# EAGLE design carte_bouton (EAGLE 6.5.0)
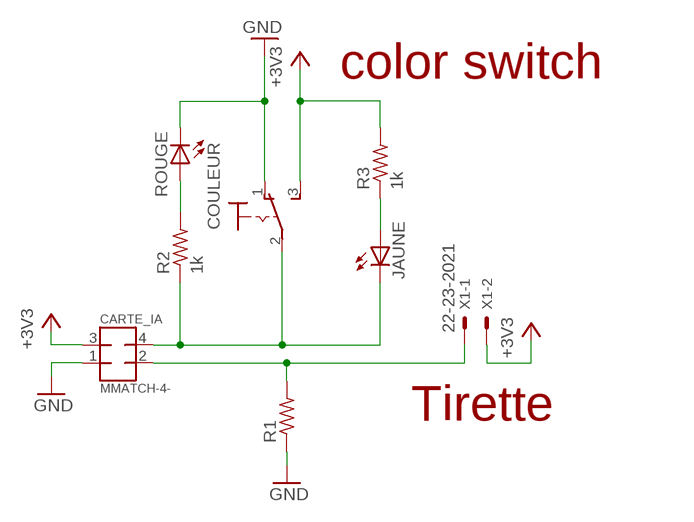
[diagram p0: schematic, sheet 1]

## Parts
CARTE_IA  MMATCH-4-  [AMP-215079-4]
COULEUR  320-916  [320-916]
JAUNE  LEDSML0805  [SML0805]
R1  R-US_R0805  [R0805]
R2  1k  R-US_M0805  [M0805]
R3  1k  R-US_M0805  [M0805]
ROUGE  LEDSML0805  [SML0805]
X1  22-23-2021  [22-23-2021]

## Nets
+3V3: CARTE_IA.3 COULEUR.3(S) R3.2 X1.2
GND: CARTE_IA.1 COULEUR.1(O) R1.1 ROUGE.C
N$1: CARTE_IA.4 COULEUR.2(P) JAUNE.C R2.1
N$2: R2.2 ROUGE.A
N$3: JAUNE.A R3.1
TIRETTE: CARTE_IA.2 R1.2 X1.1

## Notes on the sheet
- color switch
- Tirette

## Library data of the parts
CARTE_IA = jt-con-micromatch:MMATCH-4-*
COULEUR = switch:320-916: TOGGLE SWITCH distributor RS Components
JAUNE ROUGE = led:LED: LED OSRAM: - CHIPLED LG R971, LG N971, LY N971, LG Q971, LY Q971, LO R971, LY R971 LH N974, LH R974 LS Q976, LO Q976, LY Q976 LO Q996 - Hyper CHIPLED LW Q18S LB Q993, LB Q99A, LB R99A - SideLED LS A670, LO A670, LY A670, LG A670, LP A670 LB A673, LV A673, LT A673, LW A673 LH A674 LY A675 LS A676, LA A676, LO A676, LY A676, LW A676 LS A679, LY A679, LG A679 - Hyper Micro SIDELED® LS Y876, LA Y876, LO Y876, LY Y876 LT Y87S - SmartLED LW L88C, LW L88S LB L89C, LB L89S, LG L890 LS L89K, LO L89K, LY L89K LS L896, LA L896, LO L896, LY L896 - TOPLED LS T670, LO T670, LY T670, LG T670, LP T670 LSG T670, LSP T670, LSY T670, LOP T670, LYG T670 LG T671, LOG T671, LSG T671 LB T673, LV T673, LT T673, LW T673 LH T674 LS T676, LA T676, LO T676, LY T676, LB T676, LH T676, LSB T676, LW T676 LB T67C, LV T67C, LT T67C, LS T67K, LO T67K, LY T67K, LW E67C LS E67B, LA E67B, LO E67B, LY E67B, LB E67C, LV E67C, LT E67C LW T67C LS T679, LY T679, LG T679 LS T770, LO T770, LY T770, LG T770, LP T770 LB T773, LV T773, LT T773, LW T773 LH T774 LS E675, LA E675, LY E675, LS T675 LS T776, LA T776, LO T776, LY T776, LB T776 LHGB T686 LT T68C, LB T68C - Hyper Mini TOPLED® LB M676 - Mini TOPLED Santana® LG M470 LS M47K, LO M47K, LY M47K Source: http://www.osram.convergy.de LUXEON: - LUMILED® LXK2-PW12-R00, LXK2-PW12-S00, LXK2-PW14-U00, LXK2-PW14-V00 LXK2-PM12-R00, LXK2-PM12-S00, LXK2-PM14-U00 LXK2-PE12-Q00, LXK2-PE12-R00, LXK2-PE12-S00, LXK2-PE14-T00, LXK2-PE14-U00 LXK2-PB12-K00, LXK2-PB12-L00, LXK2-PB12-M00, LXK2-PB14-N00, LXK2-PB14-P00, LXK2-PB14-Q00 LXK2-PR12-L00, LXK2-PR12-M00, LXK2-PR14-Q00, LXK2-PR14-R00 LXK2-PD12-Q00, LXK2-PD12-R00, LXK2-PD12-S00 LXK2-PH12-R00, LXK2-PH12-S00 LXK2-PL12-P00, LXK2-PL12-Q00, LXK2-PL12-R00 Source: www.luxeon.com KINGBRIGHT: KA-3528ASYC Source: www.kingbright.com
R1-R3 = rcl:R-US_: RESISTOR, American symbol
X1 = con-molex:22-23-2021: .100" (2.54mm) Center Header - 2 Pin; MF: MOLEX; MPN: 22-23-2021; OC_FARNELL: 1462926; OC_NEWARK: 25C3832

## Board
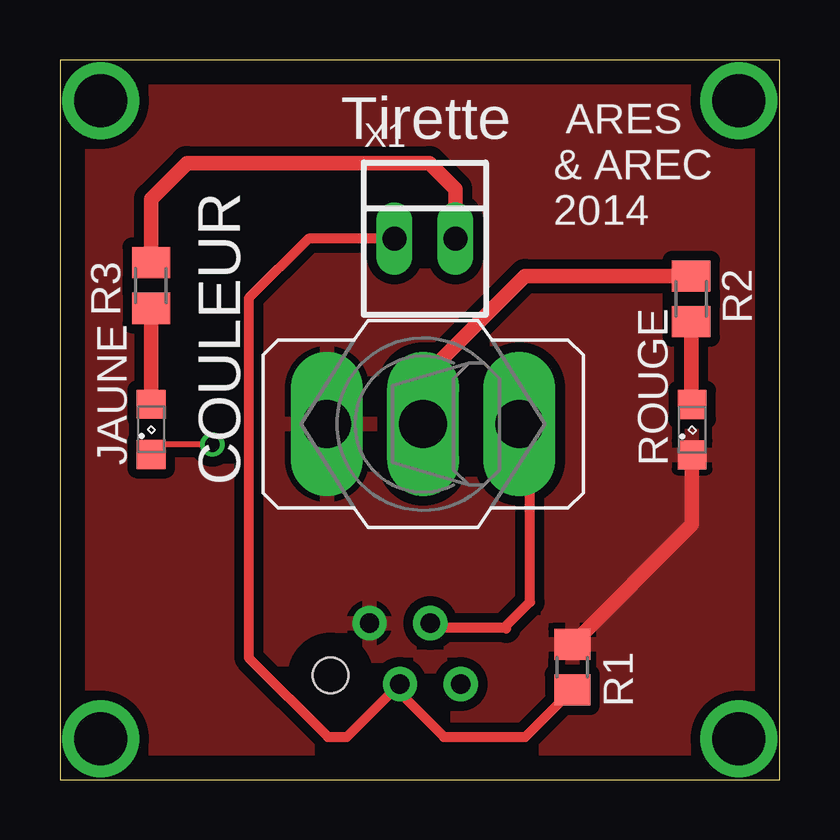
[diagram p1: board, top side]
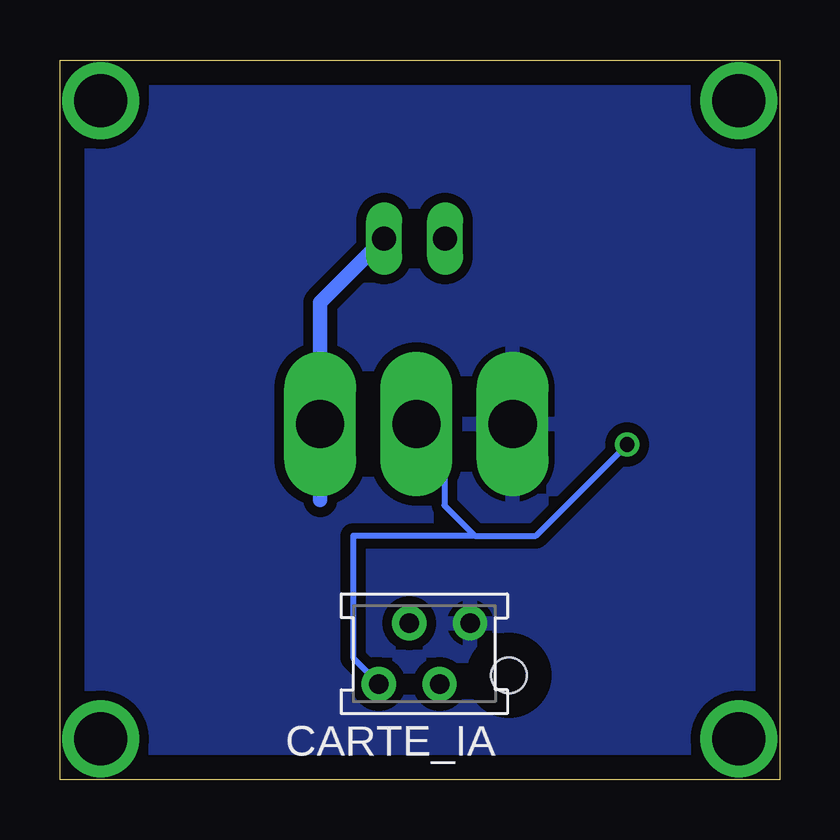
[diagram p2: board, bottom side, seen from below]

Size 30 x 30 mm. Coordinates in mm from the lower left corner, seen from the top.
Outline: 0,0 30,0 30,30 0,30 0,0
Copper layers (1*16): Top 0.035mm / dielectric 1.5mm / Bottom 0.035mm
Design rules "default": minimum track width 10mil, minimum drill 24mil, track to track 8mil, track to pad 8mil, pad to pad 8mil, via to via 8mil, smd to smd 8mil, copper to edge 40mil, drill to drill 8mil, minimum pad ring 10mil, minimum via ring 8mil, stop-mask expansion 4mil, vias tented up to drill 0mil, thermal gap 10mil

### Footprints (pad centres in the part's own frame; a part is rotated, then mirrored left to right if it is on the bottom)
AMP-215079-4 = drill 0.8 pad 1.422: 1 0,0; 2 1.27,2.54; 3 2.54,0; 4 3.81,2.54 | hole 1.5: -1.62,2.175
320-916 = drill 2.007 long: 1 0,4.013; 2 0,0; 3 0,-4.013
SML0805 = smd 1.2 x 1.2: A 1.05,0; C -1.05,0
R0805 = smd 1.3 x 1.5: 1 -0.95,0; 2 0.95,0
M0805 = smd 1.3 x 1.6: 1 -0.95,0; 2 0.95,0
22-23-2021 = drill 1 long: 1 -1.27,0; 2 1.27,0

### Placement (x,y rotation side)
CARTE_IA  12.9,6.52 180 bottom
COULEUR  15.14,14.82 90 top
JAUNE  3.8,14.6 90 top
R1  21.36,4.69 270 top
R2  26.32,20.04 270 top
R3  3.8,20.6 90 top
ROUGE  26.35,14.58 90 top
X1  15.21,22.55 0 top

### Tracks (layer width: path | path; a pad name or v marks a point on that pad's centre or on a via)
+3V3
  Top 0.254: 15.24,6.35 CARTE_IA.3 | 19.05,13.97 COULEUR.3
  Top 0.406: 15.24,6.35 18.55,6.35 18.6,6.3 18.6,6.4 19.6,7.4 19.6,14.37 COULEUR.3
  Top 0.61: X1.2 16.48,24.62 15.4,25.7 5.3,25.7 3.8,24.2 R3.2
  Bottom 0.61: X1.2 19.15,19.88 COULEUR.3 19.15,11.65
GND
  Top 0.61: R1.1 26.35,10.63 ROUGE.C
  pour Top (isolate 0.4): 0.1,0 30,0 30,30 0.1,30
  pour Bottom (isolate 0.4): 0.1,0 30,0 30,30 0.1,30
N$1  (via drill 0.61)
  Top 0.254: v6.35,13.97 3.81,13.97 JAUNE.C
  Top 0.61: COULEUR.2 15.14,16.74 19.39,20.99 R2.1
  Bottom 0.254: v6.35,13.97 10.16,10.16 12.7,10.16 | 12.7,10.16 13.97,11.43 13.97,13.97 COULEUR.2 | 12.7,10.16 17.78,10.16 17.78,5.08 16.51,3.81 CARTE_IA.4
N$2
  Top 0.61: ROUGE.A 26.32,15.66 R2.2
N$3
  Top 0.61: R3.1 JAUNE.A
N$4  (via drill 2.2 pad 2.54)
  other vias: 1.7,28.3
N$5  (via drill 2.2 pad 2.54)
  other vias: 28.3,28.3
N$6  (via drill 2.2 pad 2.54)
  other vias: 28.3,1.7
N$7  (via drill 2.2 pad 2.54)
  other vias: 1.7,1.7
TIRETTE
  Top 0.406: X1.1 10.36,22.55 7.87,20.07 7.87,5.08 11.18,1.78 11.97,1.78 CARTE_IA.2 14.17,3.61 16,1.78 19.4,1.78 R1.2

### Text on the board
tNames: Tirette | ARES / & AREC / 2014